# EAGLE schematic M837 (EAGLE 6.6.0)

## Sheet 1 of 3
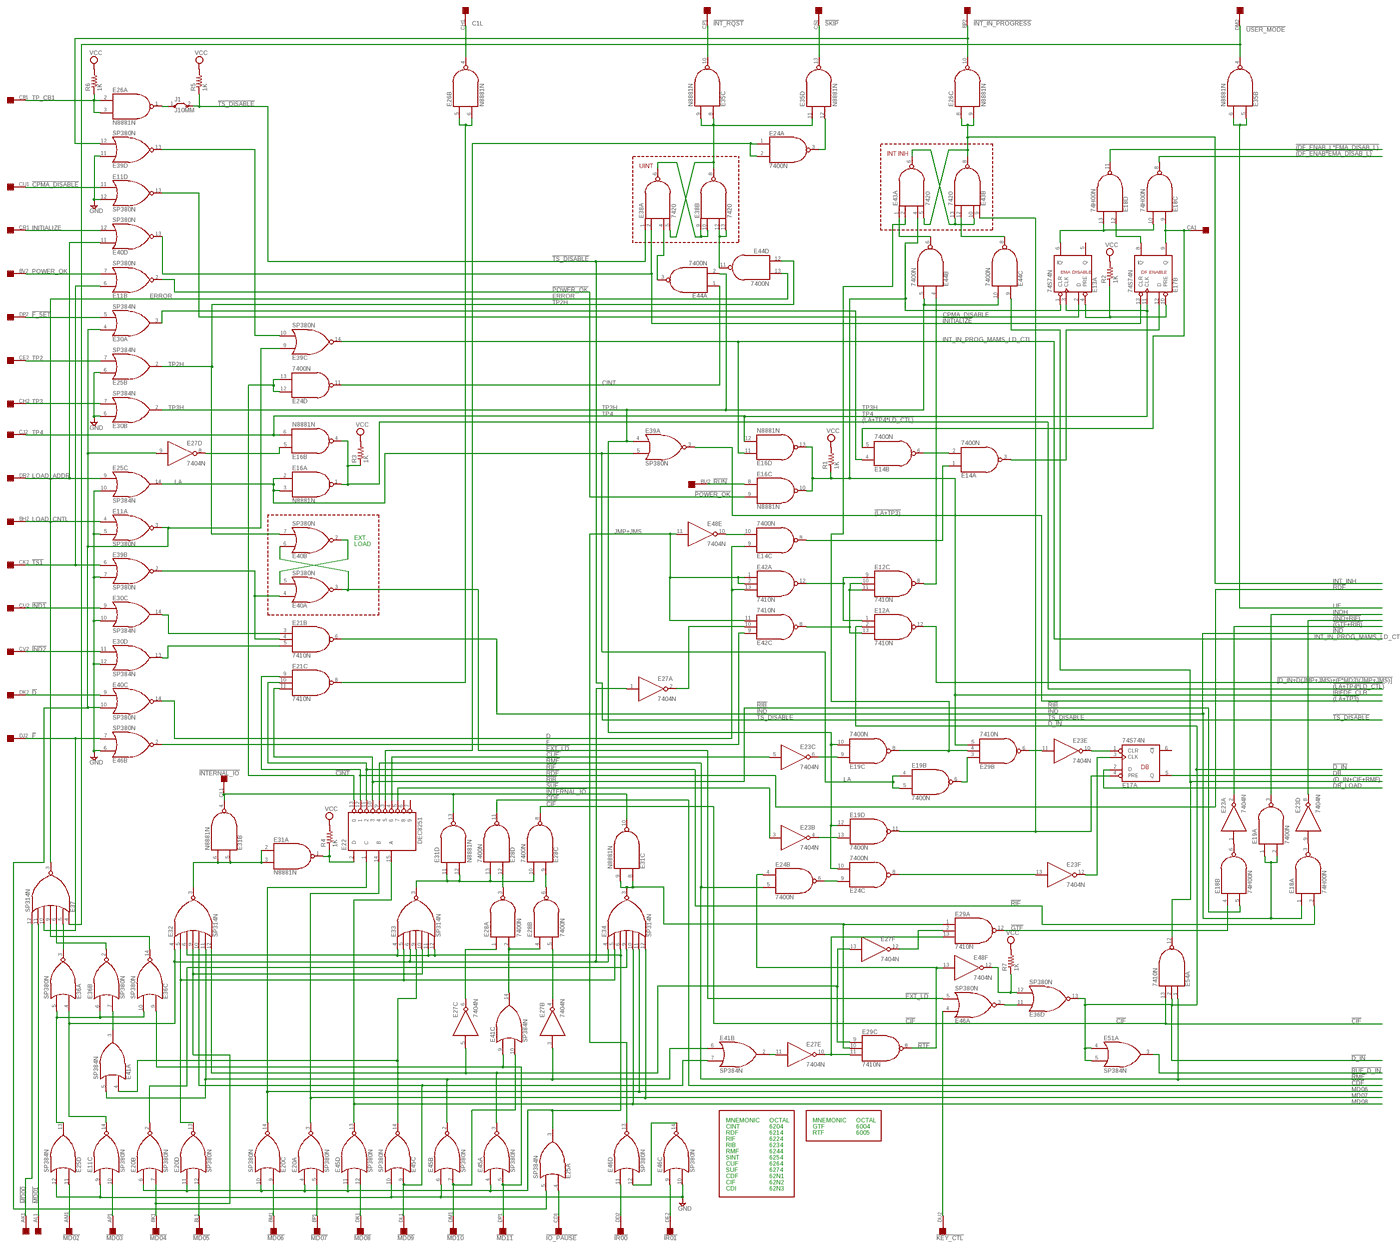
[diagram p0: schematic, sheet 1, overview]
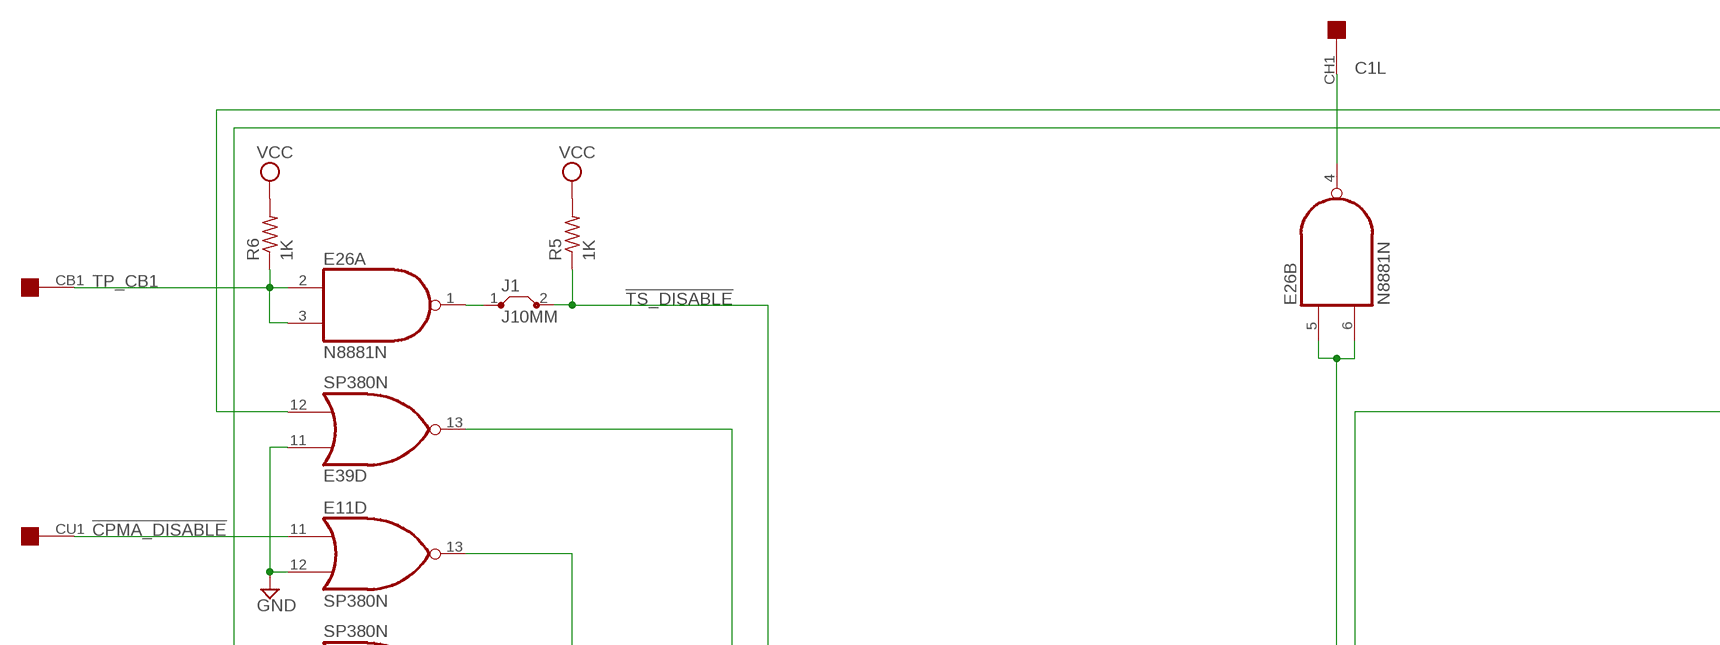
[diagram p1: schematic, sheet 1, part 1 of 4]
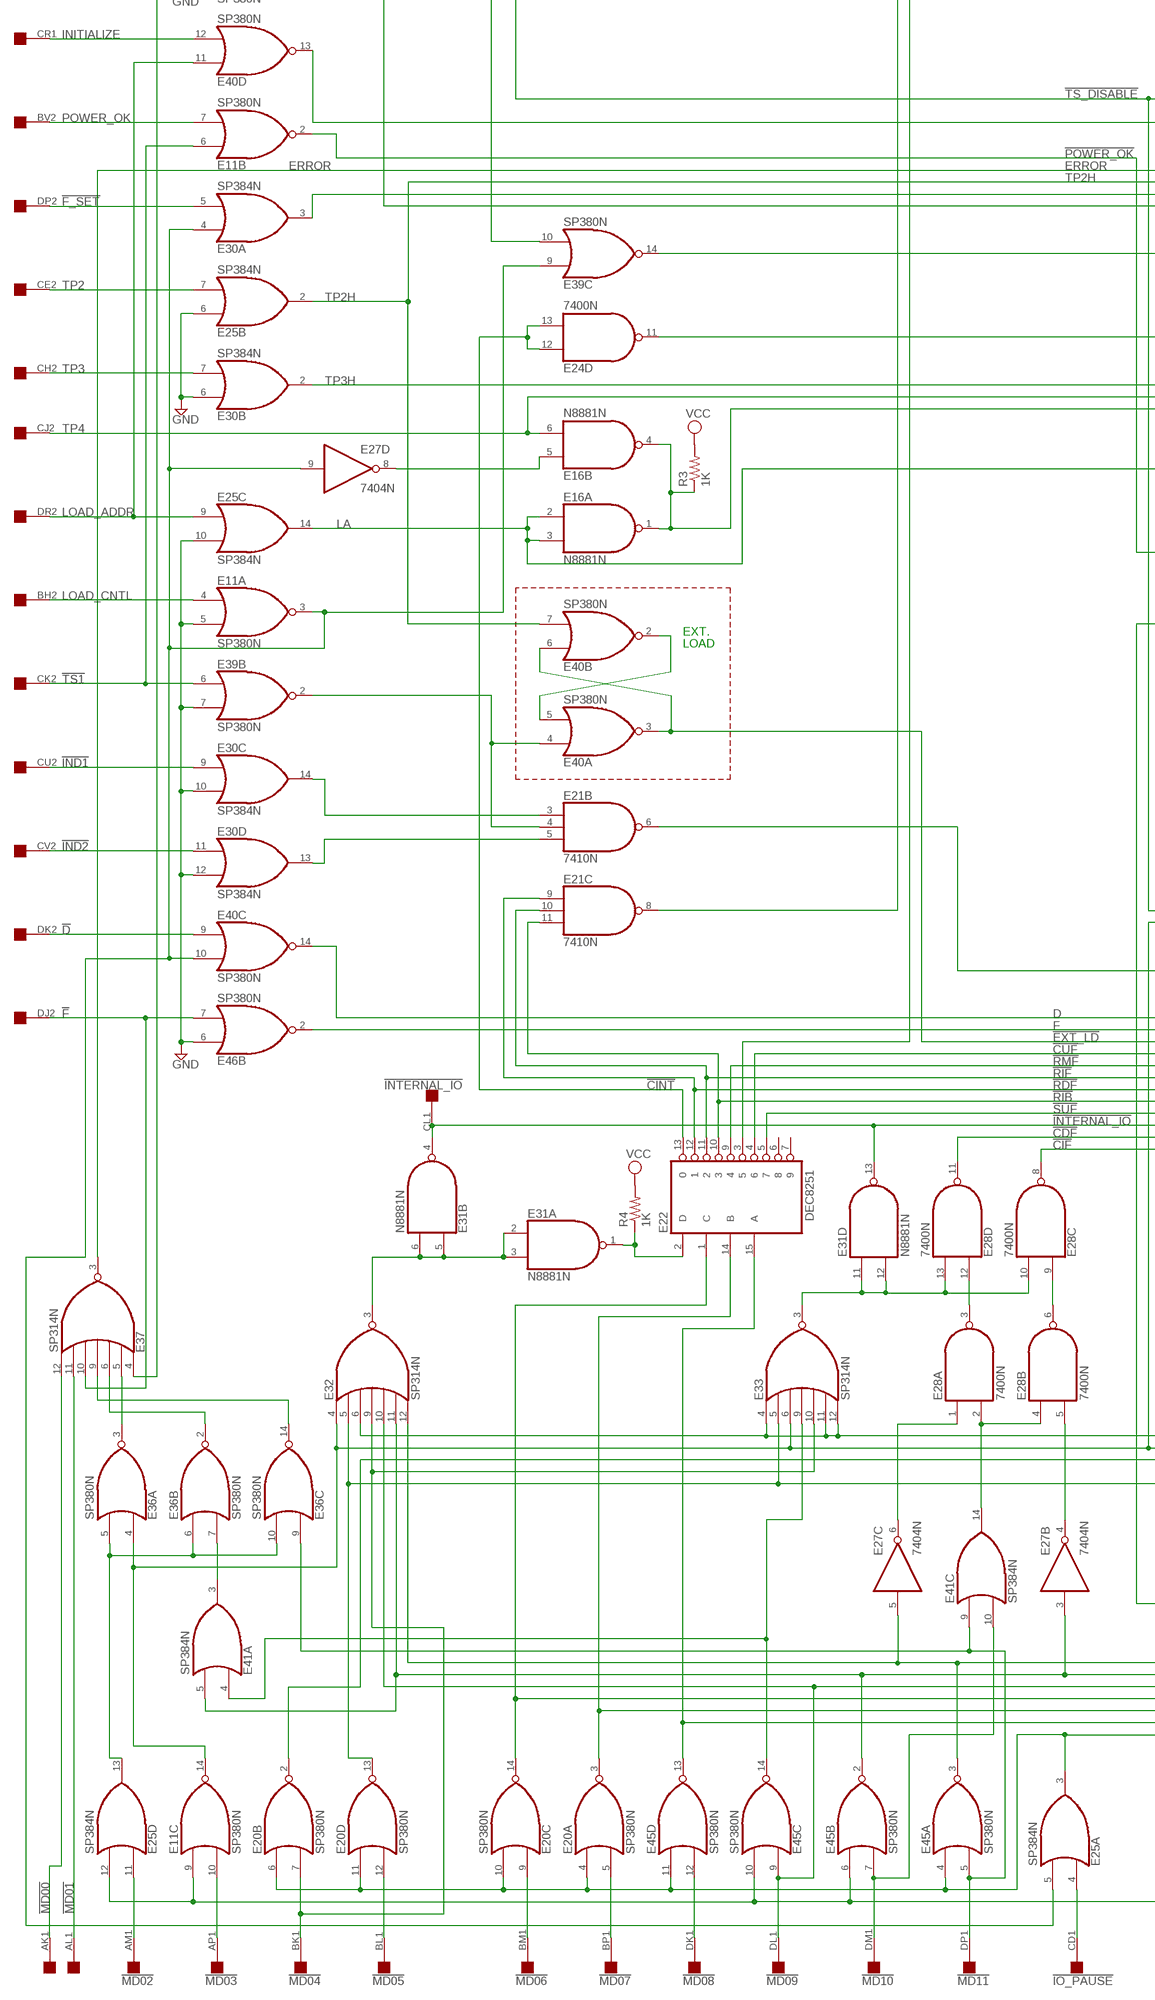
[diagram p2: schematic, sheet 1, part 2 of 4]
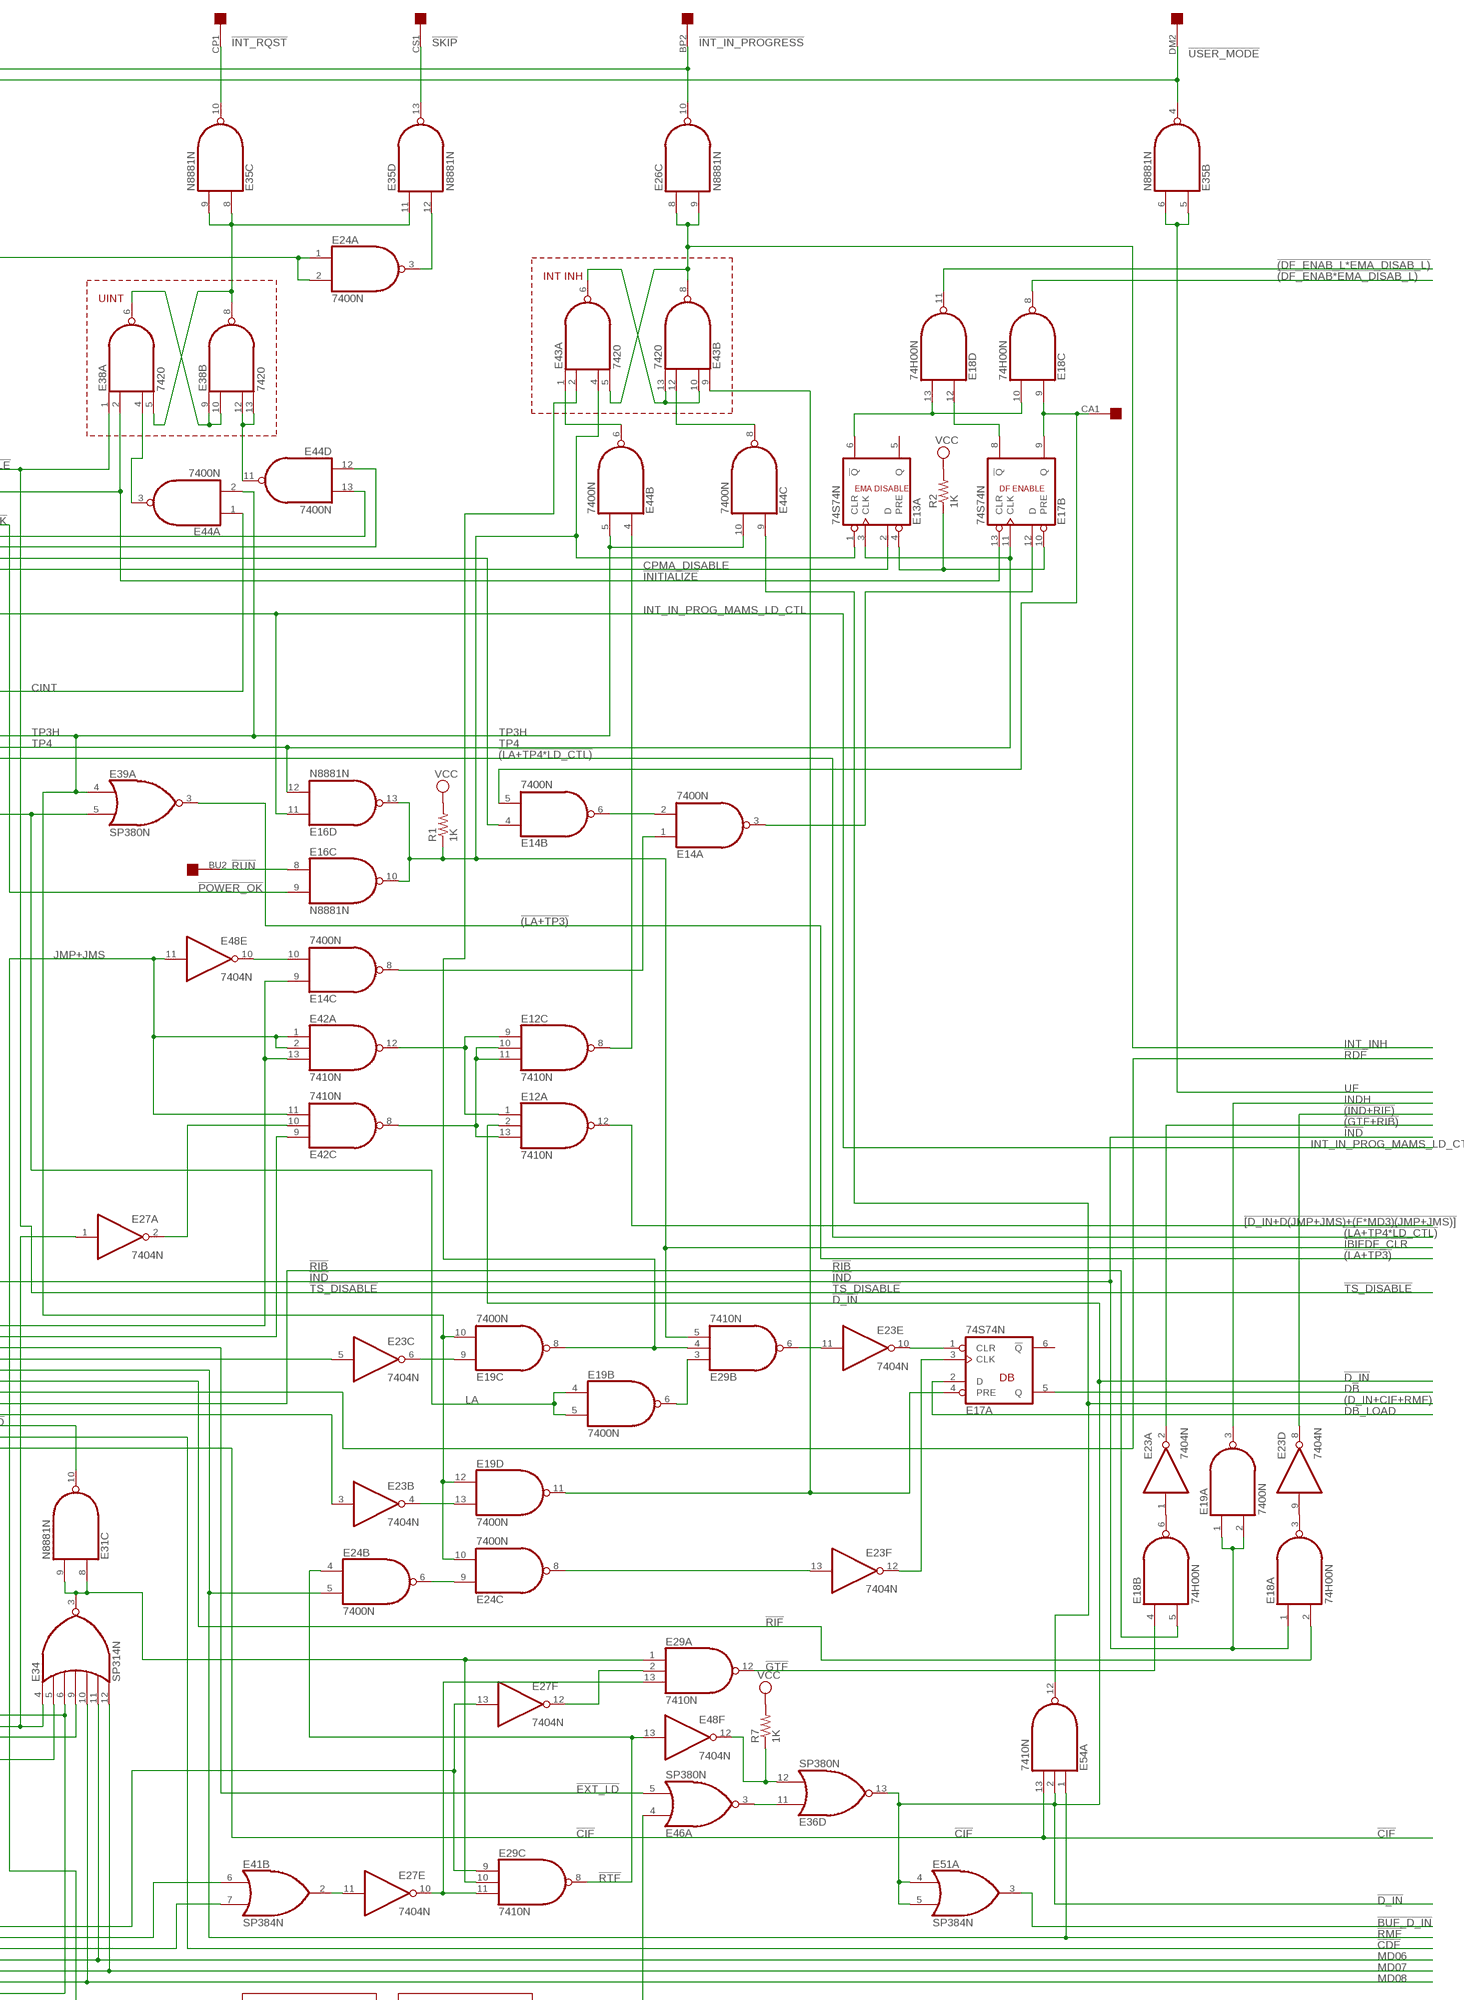
[diagram p3: schematic, sheet 1, part 3 of 4]
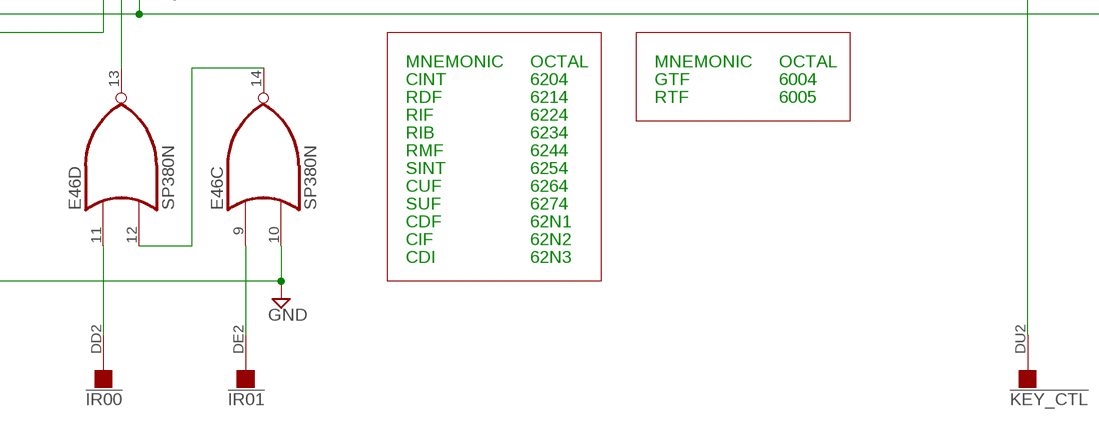
[diagram p4: schematic, sheet 1, part 4 of 4]

### Parts
E11  SP380N  [DIL14]
E12  7410N  [DIL14]
E13  74S74N  [DIL14]
E14  7400N  [DIL14]
E16  N8881N  [DIL14]
E17  74S74N  [DIL14]
E18  74H00N  74S00N  [DIL14]
E19  7400N  [DIL14]
E20  SP380N  [DIL14]
E21  7410N  [DIL14]
E22  DEC8251  [DIL16]
E23  7404N  [DIL14]
E24  7400N  [DIL14]
E25  SP384N  [DIL14]
E26  N8881N  [DIL14]
E27  7404N  [DIL14]
E28  7400N  [DIL14]
E29  7410N  74S10N  [DIL14]
E30  SP384N  [DIL14]
E31  N8881N  [DIL14]
E32  SP314N  [DIL14]
E33  SP314N  [DIL14]
E34  SP314N  [DIL14]
E35  N8881N  [DIL14]
E36  SP380N  [DIL14]
E37  SP314N  [DIL14]
E38  7420  74S20N  [DIL14]
E39  SP380N  [DIL14]
E40  SP380N  [DIL14]
E41  SP384N  [DIL14]
E42  7410N  [DIL14]
E43  7420  74S20N  [DIL14]
E44  7400N  [DIL14]
E45  SP380N  [DIL14]
E46  SP380N  [DIL14]
E48  7404N  [DIL14]
E51  SP384N  [DIL14]
E54  7410N  [DIL14]
EDGE  QUAD  [EDGE-CON8]
J1  J10MM  [10]
R1  1K  R-US_0207/10  [0207/10]
R2  1K  R-US_0207/10  [0207/10]
R3  1K  R-US_0207/10  [0207/10]
R4  1K  R-US_0207/10  [0207/10]
R5  1K  R-US_0207/10  [0207/10]
R6  1K  R-US_0207/10  [0207/10]
R7  1K  R-US_0207/10  [0207/10]

### Nets
!(DF_ENAB*EMA_DISAB_L): E18.8(C:O)
!(DF_ENAB_L*EMA_DISAB_L): E18.11(D:O)
!(GTF+RIB): E23.2(A:O) ; also sheet 2
!(IND+RIF): E23.8(D:O) ; also sheet 2
!(LA+TP3): E39.3(A:O) ; also sheet 2
!(LA+TP4*LD_CTL): E16.1(A:O) E16.4(B:O) R3.1 ; also sheet 2
![D_IN+D(JMP+JMS)+(F*MD3)(JMP+JMS)]: E12.12(A:O) ; also sheet 2
!BUF_D_IN: E51.3(A:O) ; also sheet 2
!CDF: E28.11(D:O) ; also sheet 2
!CIF: E28.8(C:O) E54.13(A:I2) ; also sheet 2
!CINT: E22.13 E24.12(D:I0) E24.13(D:I1)
!CPMA_DISABLE: E11.11(D:I0) EDGE.CU1
!CUF: E22.4 E23.5(C:I)
!D: E40.9(C:I0) EDGE.DK2
!D_IN: E12.2(A:I1) E36.13(D:O) E51.4(A:I0) E51.5(A:I1) E54.2(A:I1) ; also sheet 2
!DF_ENABLE: E17.8(B:!Q) E18.12(D:I0)
!EXT_LD: E40.3(A:O) E40.6(B:I0) E46.5(A:I1)
!F: E37.10(I4) E46.7(B:I1) EDGE.DJ2
!F_SET: E30.5(A:I1) EDGE.DP2
!GTF: E18.4(B:I0) E29.12(A:O)
!IBIFDF_CLR: E13.1(A:CLR) E16.10(C:O) E16.13(D:O) E29.5(B:I2) E43.4(A:I2) R1.1 ; also sheet 2
!IND: E18.1(A:I0) E19.1(A:I0) E19.2(A:I1) E21.6(B:O) ; also sheet 2
!IND1: E30.9(C:I0) EDGE.CU2
!IND2: E30.11(D:I0) EDGE.CV2
!INITIALIZE: E17.13(B:CLR) E38.2(A:I1) E40.13(D:O)
!INT_IN_PROGRESS: E26.10(C:O) E39.12(D:I1) EDGE.BP2
!INT_RQST: E35.10(C:O) EDGE.CP1
!INTERNAL_IO: E31.4(B:O) E31.10(C:O) E31.13(D:O) EDGE.CL1
!IO_PAUSE: E25.4(A:I0) EDGE.CD1
!IR00: E46.11(D:I0) EDGE.DD2
!IR01: E46.9(C:I0) EDGE.DE2
!KEY_CTL: E46.4(A:I0) EDGE.DU2
!LOAD_CNTL: E11.3(A:O) E25.5(A:I1) E27.9(D:I) E30.4(A:I0) E39.9(C:I0) E40.10(C:I1)
!MD00: E37.12(I6) EDGE.AK1
!MD01: E37.11(I5) EDGE.AL1
!MD02: E25.11(D:I0) EDGE.AM1
!MD03: E11.10(C:I1) EDGE.AP1
!MD04: E20.7(B:I1) E32.9(I3) E33.10(I4) EDGE.BK1
!MD05: E20.12(D:I1) EDGE.BL1
!MD06: E20.9(C:I0) EDGE.BM1
!MD07: E20.5(A:I1) EDGE.BP1
!MD08: E45.12(D:I1) EDGE.DK1
!MD09: E32.10(I4) E41.7(B:I1) E45.9(C:I0) EDGE.DL1
!MD10: E41.10(C:I1) E45.7(B:I1) EDGE.DM1
!MD11: E36.9(C:I0) E41.9(C:I0) E45.5(A:I1) EDGE.DP1
!POWER_OK: E11.2(B:O) E16.9(C:I1)
!RDF: E21.9(C:I0) E22.12 ; also sheet 2
!RIB: E18.5(B:I1) E21.11(C:I2) E22.10
!RIF: E18.2(A:I1) E21.10(C:I1) E22.11
!RMF: E22.9 E24.5(B:I1) E54.1(A:I0) ; also sheet 2
!RTF: E24.4(B:I0) E29.8(C:O) E48.13(F:I)
!RUN: E16.8(C:I0) EDGE.BU2
!SINT: E22.3 E24.1(A:I0) E24.2(A:I1)
!SKIP: E35.13(D:O) EDGE.CS1
!SUF: E22.5 E23.3(B:I)
!TS1: E11.6(B:I0) E39.6(B:I0) EDGE.CK2
!TS_DISABLE [Supply]: E38.1(A:I0) J1.2 R5.1 ; also sheet 2
!USER_MODE: E35.4(B:O) E37.4(I0) EDGE.DM2
(D_IN+CIF+RMF): E44.9(C:I0) E54.12(A:O) ; also sheet 2
C1L: E26.4(B:O) EDGE.CH1
CINT: E24.11(D:O) E44.1(A:I0)
CPMA_DISABLE: E11.13(D:O) E13.2(A:D)
D: E14.9(C:I0) E40.14(C:O) E42.13(A:I2)
DB: E17.5(A:Q) ; also sheet 2
DB_LOAD: E17.2(A:D) ; also sheet 2
DF_ENABLE: E14.5(B:I1) E17.9(B:Q) E18.9(C:I0) EDGE.CA1
ERROR: E37.3(O) E44.13(D:I1)
F: E42.9(C:I0) E46.2(B:O)
GND [Supply]: E11.5(A:I1) E11.9(C:I0) E11.12(D:I1) E25.6(B:I0) E25.10(C:I1) E25.12(D:I1) E30.6(B:I0) E30.10(C:I1) E30.12(D:I1) E39.7(B:I1) E39.11(D:I0) E45.6(B:I0) E45.10(C:I1) E46.6(B:I0) E46.10(C:I1) ; also sheet 2,3
IND1L: E21.3(B:I0) E30.14(C:O)
IND2L: E21.5(B:I2) E30.13(D:O)
INDH: E19.3(A:O) ; also sheet 2
INITIALIZE: E40.12(D:I1) EDGE.CR1
INT_IN_PROG_MAMS_LD_CTL: E16.11(D:I0) E39.14(C:O) ; also sheet 2
INT_IN_PROGRESS: E39.10(C:I1) E39.13(D:O)
INT_INH: E26.8(C:I0) E26.9(C:I1) E43.5(A:I3) E43.8(B:O) ; also sheet 2
IR01: E46.12(D:I1) E46.14(C:O)
JMP+JMS: E42.1(A:I0) E42.2(A:I1) E42.11(C:I2) E46.13(D:O) E48.11(E:I)
LA: E16.2(A:I0) E16.3(A:I1) E19.4(B:I0) E19.5(B:I1) E25.14(C:O) E39.5(A:I1)
LOAD_ADDR: E25.9(C:I0) E40.11(D:I0) EDGE.DR2
LOAD_CNTL: E11.4(A:I0) EDGE.BH2
LOAD_CNTLH: E16.5(B:I0) E27.8(D:O)
MD03: E11.14(C:O) E27.1(A:I) E32.4(I0) E33.6(I2) E34.4(I0) E36.4(A:I0)
MD03L: E27.2(A:O) E42.10(C:I1)
MD06: E20.14(C:O) E22.1(C) E34.11(I5) ; also sheet 2
MD07: E20.3(A:O) E22.14(B) E34.12(I6) ; also sheet 2
MD08: E22.15(A) E34.10(I4) E45.13(D:O) ; also sheet 2
MD09: E33.9(I3) E41.4(A:I0) E45.14(C:O)
MD10: E27.3(B:I) E32.11(I5) E41.5(A:I1) E41.6(B:I0) E45.2(B:O)
MYC1: E21.8(C:O) E26.5(B:I0) E26.6(B:I1)
N$1: E24.3(A:O) E35.12(D:I1)
N$2 [Supply]: E26.1(A:O) J1.1
N$3: E27.10(E:O) E29.11(C:I2) E29.13(A:I2)
N$4: E22.2(D) E31.1(A:O) R4.1
N$5: E31.2(A:I0) E31.3(A:I1) E31.5(B:I0) E31.6(B:I1) E32.3(O)
N$6: E36.3(A:O) E37.5(I1)
N$8: E36.2(B:O) E37.6(I2)
N$9: E36.14(C:O) E37.9(I3)
N$11: E14.2(A:I1) E14.6(B:O)
N$13: E38.4(A:I2) E44.3(A:O)
N$14: E40.2(B:O) E40.5(A:I1)
N$19: E27.11(E:I) E41.2(B:O)
N$21: E38.12(B:I2) E38.13(B:I3) E44.11(D:O)
N$22: E20.4(A:I0) E20.6(B:I0) E20.10(C:I1) E20.11(D:I0) E25.3(A:O) E32.6(I2) E33.4(I0) E33.11(I5) E33.12(I6) E34.6(I2) E45.4(A:I0) E45.11(D:I0)
N$23: E38.6(A:O) E38.9(B:I0) E38.10(B:I1)
N$24: E23.13(F:I) E24.8(C:O)
N$25: E43.6(A:O) E43.10(B:I1) E43.13(B:I3)
N$26: E25.13(D:O) E36.5(A:I1) E36.6(B:I0) E36.10(C:I1)
N$27: E29.1(A:I0) E29.10(C:I1) E31.8(C:I0) E31.9(C:I1) E34.3(O)
N$28: E14.1(A:I0) E14.8(C:O)
N$29: E36.7(B:I1) E41.3(A:O)
N$32: E17.3(A:CLK) E23.12(F:O)
N$33: E20.2(B:O) E34.9(I3)
N$34: E20.13(D:O) E32.5(I1) E33.5(I1) E34.5(I1)
N$36: E14.10(C:I1) E48.10(E:O)
N$37: E18.3(A:O) E23.9(D:I)
N$40: E12.10(C:I1) E12.11(C:I2) E12.13(A:I2) E42.8(C:O)
N$42: E13.4(A:PRE) E17.10(B:PRE) R2.1
N$43: E14.4(B:I0) E30.3(A:O)
N$44: E12.1(A:I0) E12.9(C:I0) E42.12(A:O)
N$47: E18.6(B:O) E23.1(A:I)
N$49: E14.3(A:O) E17.12(B:D)
N$50: E28.2(A:I1) E28.4(B:I0) E41.14(C:O)
N$51: E13.6(A:!Q) E18.10(C:I1) E18.13(D:I1)
N$52: E19.6(B:O) E29.3(B:I0)
N$53: E19.8(C:O) E29.4(B:I1) E43.2(A:I1)
N$54: E28.10(C:I1) E28.13(D:I1) E31.11(D:I0) E31.12(D:I1) E33.3(O)
N$55: E28.3(A:O) E28.12(D:I0)
N$56: E28.6(B:O) E28.9(C:I0)
N$57: E27.5(C:I) E27.13(F:I) E29.9(C:I0) E32.12(I6) E45.3(A:O)
N$58: E27.6(C:O) E28.1(A:I0)
N$59: E27.4(B:O) E28.5(B:I1)
N$62: E24.6(B:O) E24.9(C:I0)
N$63: E19.13(D:I1) E23.4(B:O)
N$64: E19.9(C:I0) E23.6(C:O)
N$65: E17.1(A:CLR) E23.10(E:O)
N$66: E23.11(E:I) E29.6(B:O)
N$67: E27.12(F:O) E29.2(A:I1)
N$68: E36.11(D:I0) E46.3(A:O)
N$69: E17.4(A:PRE) E19.11(D:O) E43.9(B:I0)
N$71: E12.8(C:O) E44.4(B:I0)
N$72: E43.1(A:I0) E44.6(B:O)
N$73: E43.12(B:I2) E44.8(C:O)
POWER_OK: E11.7(B:I1) EDGE.BV2
RTF: E36.12(D:I1) E48.12(F:O) R7.1
TP2: E25.7(B:I1) EDGE.CE2
TP2H: E25.2(B:O) E40.7(B:I1) E44.12(D:I0)
TP3: E30.7(B:I1) EDGE.CH2
TP3H: E19.10(C:I1) E19.12(D:I0) E24.10(C:I1) E30.2(B:O) E39.4(A:I0) E44.2(A:I1) E44.5(B:I1) E44.10(C:I1)
TP4: E13.3(A:CLK) E16.6(B:I1) E16.12(D:I1) E17.11(B:CLK) EDGE.CJ2
TP_CB1: E26.2(A:I0) E26.3(A:I1) EDGE.CB1 R6.1
TS1: E21.4(B:I1) E39.2(B:O) E40.4(A:I0)
UF: E35.5(B:I0) E35.6(B:I1) ; also sheet 2
UINT: E35.8(C:I0) E35.9(C:I1) E35.11(D:I0) E38.5(A:I3) E38.8(B:O)
VCC [Supply]: R1.2 R2.2 R3.2 R4.2 R5.2 R6.2 R7.2 ; also sheet 2,3
Unconnected: E13.5(A:Q) E13.8(B:!Q) E13.9(B:Q) E13.10(B:PRE) E13.11(B:CLK) E13.12(B:D) E13.13(B:CLR) E17.6(A:!Q) E21.1(A:I0) E21.2(A:I1) E21.12(A:O) E21.13(A:I2) E22.6 E22.7 E26.11(D:I0) E26.12(D:I1) E26.13(D:O) E35.1(A:O) E35.2(A:I0) E35.3(A:I1) E41.11(D:I0) E41.12(D:I1) E41.13(D:O) E42.3(B:I0) E42.4(B:I1) E42.5(B:I2) E42.6(B:O) E48.1(A:I) E48.2(A:O) E48.3(B:I) E48.4(B:O) E54.8(C:O) E54.9(C:I0) E54.10(C:I1) E54.11(C:I2) EDGE.AB2 EDGE.AC1 EDGE.AD1 EDGE.AE1 EDGE.AH1 EDGE.AJ1 EDGE.AJ2 EDGE.AK2 EDGE.AL2 EDGE.AM2 EDGE.AN1 EDGE.AN2 EDGE.AP2 EDGE.AR1 EDGE.AR2 EDGE.AS1 EDGE.AS2 EDGE.AU1 EDGE.AU2 EDGE.AV2 EDGE.BB2 EDGE.BD1 EDGE.BD2 EDGE.BE1 EDGE.BE2 EDGE.BH1 EDGE.BJ1 EDGE.BJ2 EDGE.BK2 EDGE.BL2 EDGE.BM2 EDGE.BN1 EDGE.BN2 EDGE.BR1 EDGE.BR2 EDGE.BS2 EDGE.CB2 EDGE.CD2 EDGE.CE1 EDGE.CJ1 EDGE.CK1 EDGE.CL2 EDGE.CM1 EDGE.CM2 EDGE.CN1 EDGE.CN2 EDGE.CP2 EDGE.CR2 EDGE.CS2 EDGE.CV1 EDGE.DA1 EDGE.DA2 EDGE.DB1 EDGE.DB2 EDGE.DD1 EDGE.DE1 EDGE.DH1 EDGE.DH2 EDGE.DJ1 EDGE.DL2 EDGE.DN1 EDGE.DN2 EDGE.DS2 EDGE.DV2

### Notes on the sheet
- INT INH
- UINT
- EMA DISABLE | DF ENABLE
- EXT.
- LOAD
- DB
- MNEMONIC | OCTAL | MNEMONIC | OCTAL
- CINT | 6204 | GTF | 6004
- RDF | 6214 | RTF | 6005
- RIF | 6224
- RIB | 6234
- RMF | 6244
- SINT | 6254
- CUF | 6264
- SUF | 6274
- CDF | 62N1
- CIF | 62N2
- CDI | 62N3

## Sheet 2 of 3
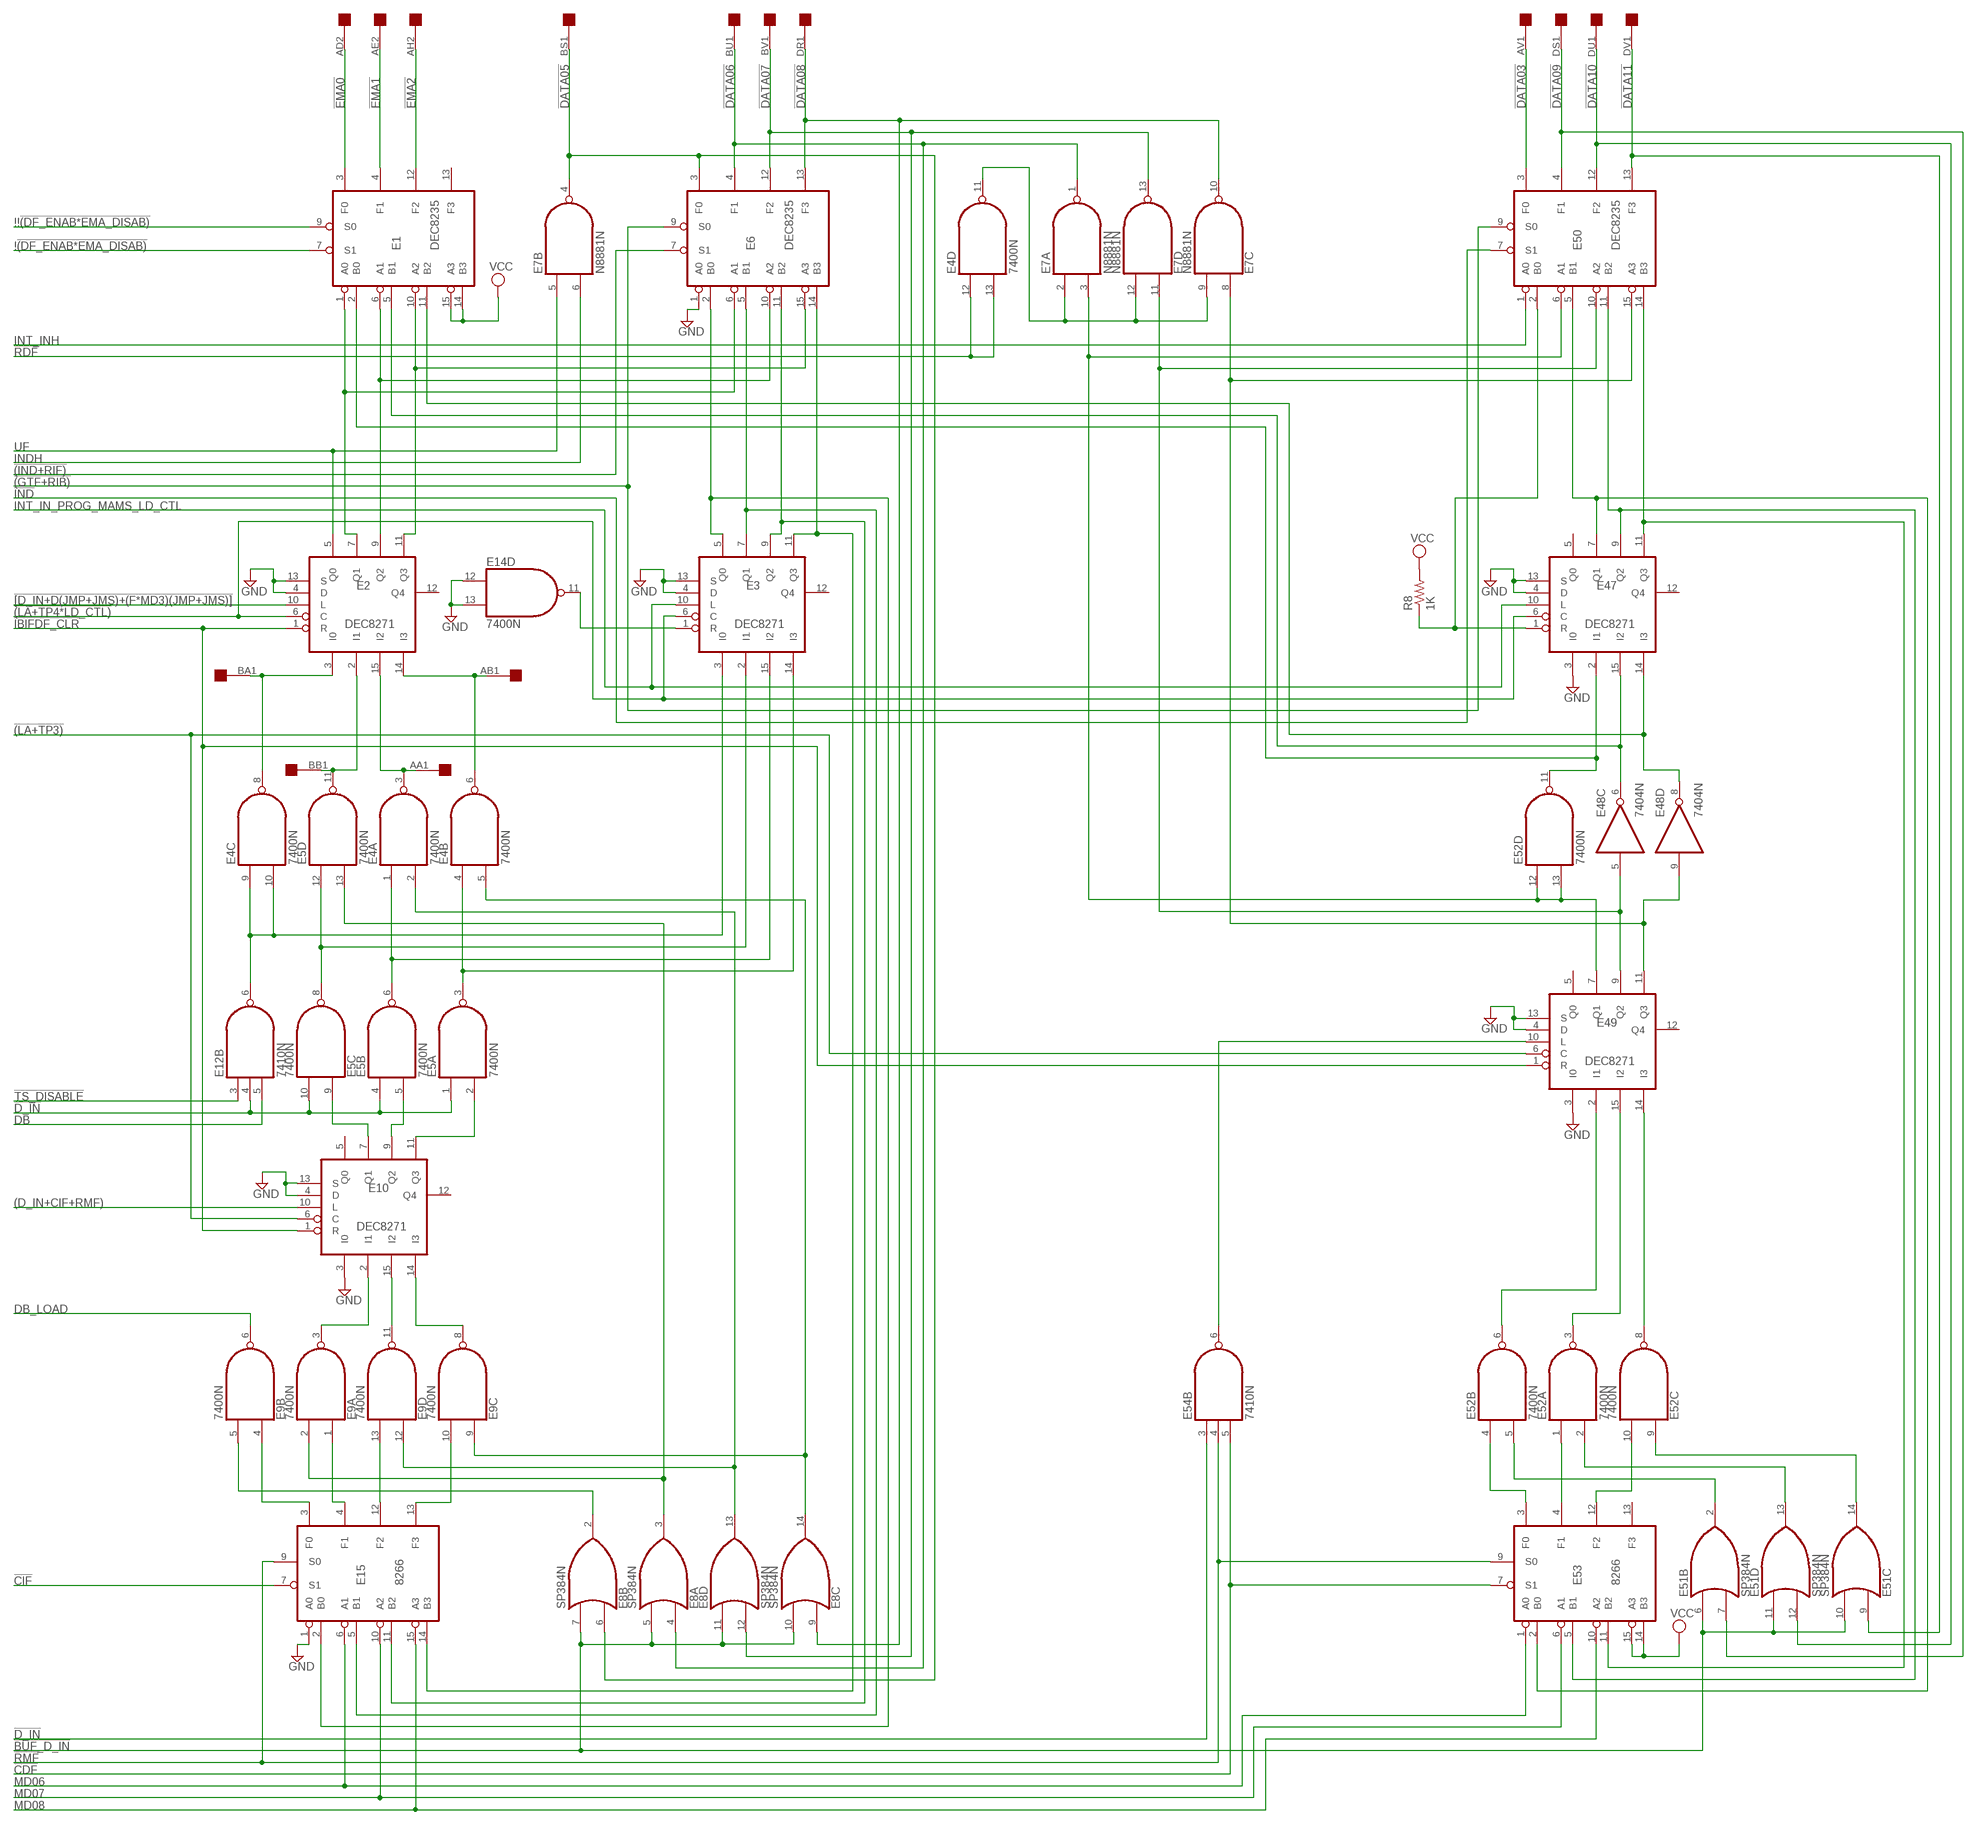
[diagram p5: schematic, sheet 2]

### Parts
E1  DEC8235  [DIL16]
E2  DEC8271  [DIL16]
E3  DEC8271  [DIL16]
E4  7400N  [DIL14]
E5  7400N  [DIL14]
E6  DEC8235  [DIL16]
E7  N8881N  [DIL14]
E8  SP384N  [DIL14]
E9  7400N  [DIL14]
E10  DEC8271  [DIL16]
E15  8266  [DIL16]
E47  DEC8271  [DIL16]
E49  DEC8271  [DIL16]
E50  DEC8235  [DIL16]
E52  7400N  [DIL14]
E53  8266  [DIL16]
R8  1K  R-US_0207/10  [0207/10]

### Nets
!!!(DF_ENAB*EMA_DISAB): E1.9(S0)
!!(DF_ENAB*EMA_DISAB): E1.7(S1)
!(GTF+RIB): E6.9(S0) E50.9(S0) ; also sheet 1
!(IND+RIF): E6.7(S1) ; also sheet 1
!(LA+TP3): E10.6(C) E49.6(C) ; also sheet 1
!(LA+TP4*LD_CTL): E2.6(C) E3.6(C) E47.6(C) ; also sheet 1
![D_IN+D(JMP+JMS)+(F*MD3)(JMP+JMS)]: E2.10(L) ; also sheet 1
!BUF_D_IN: E8.5(A:I1) E8.7(B:I1) E8.10(C:I1) E8.11(D:I0) E51.6(B:I0) E51.10(C:I1) E51.11(D:I0) ; also sheet 1
!CDF: E53.7(S1) E54.5(B:I2) ; also sheet 1
!CIF: E15.7(S1) ; also sheet 1
!D_IN: E5.1(A:I0) E5.4(B:I0) E5.10(C:I1) E12.4(B:I1) E54.3(B:I0) ; also sheet 1
!DATA03: E50.3(F0) EDGE.AV1
!DATA05: E6.3(F0) E7.4(B:O) E8.6(B:I0) EDGE.BS1
!DATA06: E6.4(F1) E7.1(A:O) E8.4(A:I0) EDGE.BU1
!DATA07: E6.12(F2) E7.13(D:O) E8.12(D:I1) EDGE.BV1
!DATA08: E6.13(F3) E7.10(C:O) E8.9(C:I0) EDGE.DR1
!DATA09: E50.4(F1) E51.7(B:I1) EDGE.DS1
!DATA10: E50.12(F2) E51.12(D:I1) EDGE.DU1
!DATA11: E50.13(F3) E51.9(C:I0) EDGE.DV1
!EMA0: E1.3(F0) EDGE.AD2
!EMA1: E1.4(F1) EDGE.AE2
!EMA2: E1.12(F2) EDGE.AH2
!IBIFDF_CLR: E2.1(R) E10.1(R) E49.1(R) ; also sheet 1
!IND: E50.7(S1) ; also sheet 1
!RDF: E4.12(D:I0) E4.13(D:I1) ; also sheet 1
!RMF: E15.9(S0) E53.9(S0) E54.4(B:I1) ; also sheet 1
!TS_DISABLE [Supply]: E12.3(B:I0) ; also sheet 1
(D_IN+CIF+RMF): E10.10(L) ; also sheet 1
DB: E12.5(B:I2) ; also sheet 1
DB_LOAD: E9.6(B:O) ; also sheet 1
GND [Supply]: E2.4(D) E2.13(S) E3.4(D) E3.13(S) E6.1(A0) E10.3(I0) E10.4(D) E10.13(S) E14.12(D:I0) E14.13(D:I1) E15.1(A0) E47.3(I0) E47.4(D) E47.13(S) E49.3(I0) E49.4(D) E49.13(S) ; also sheet 1,3
INDH: E7.6(B:I1) ; also sheet 1
INT_IN_PROG_MAMS_LD_CTL: E3.10(L) E47.10(L) ; also sheet 1
INT_INH: E50.1(A0) ; also sheet 1
MD06: E15.6(A1) E53.1(A0) ; also sheet 1
MD07: E15.10(A2) E53.6(A1) ; also sheet 1
MD08: E15.15(A3) E53.10(A2) ; also sheet 1
N$10: E3.5(Q0) E6.2(B0) E15.2(B0)
N$20: E3.7(Q1) E6.5(B1) E15.5(B1)
N$45: E3.9(Q2) E6.11(B2) E15.11(B2)
N$60: E3.11(Q3) E6.14(B3) E15.14(B3)
N$74: E9.4(B:I0) E15.3(F0)
N$75: E9.1(A:I0) E15.4(F1)
N$76: E9.13(D:I1) E15.12(F2)
N$77: E9.10(C:I1) E15.13(F3)
N$78: E8.2(B:O) E9.5(B:I1)
N$79: E5.13(D:I1) E8.3(A:O) E9.2(A:I1)
N$80: E4.2(A:I1) E8.13(D:O) E9.12(D:I0)
N$81: E4.5(B:I1) E8.14(C:O) E9.9(C:I0)
N$82: E9.11(D:O) E10.15(I2)
N$83: E9.3(A:O) E10.2(I1)
N$84: E9.8(C:O) E10.14(I3)
N$86: E3.14(I3) E4.4(B:I0) E5.3(A:O)
N$87: E3.15(I2) E4.1(A:I0) E5.6(B:O)
N$88: E5.9(C:I0) E10.7(Q1)
N$89: E5.5(B:I1) E10.9(Q2)
N$90: E5.2(A:I1) E10.11(Q3)
N$93: E3.2(I1) E5.8(C:O) E5.12(D:I0)
N$94: E3.3(I0) E4.9(C:I0) E4.10(C:I1) E12.6(B:O)
N$102: E1.1(A0) E2.7(Q1) E6.6(A1)
N$103: E1.6(A1) E2.9(Q2) E6.10(A2)
N$104: E1.10(A2) E2.11(Q3) E6.15(A3)
N$105: E1.11(B2) E47.14(I3) E48.8(D:O)
N$106: E1.5(B1) E47.15(I2) E48.6(C:O)
N$107: E1.2(B0) E47.2(I1) E52.11(D:O)
N$110: E49.10(L) E54.6(B:O)
N$118: E7.11(D:I0) E48.5(C:I) E49.9(Q2) E50.10(A2)
N$119: E7.8(C:I0) E48.9(D:I) E49.11(Q3) E50.15(A3)
N$120: E51.2(B:O) E52.5(B:I1)
N$121: E7.3(A:I1) E49.7(Q1) E50.6(A1) E52.12(D:I0) E52.13(D:I1)
N$122: E51.13(D:O) E52.2(A:I1)
N$124: E51.14(C:O) E52.9(C:I0)
N$126: E52.1(A:I0) E53.4(F1)
N$128: E47.11(Q3) E50.14(B3) E53.11(B2)
N$129: E47.9(Q2) E50.11(B2) E53.5(B1)
N$130: E47.7(Q1) E50.5(B1) E53.2(B0)
N$135: E52.10(C:I1) E53.12(F2)
N$137: E3.1(R) E14.11(D:O)
N$140: E52.4(B:I0) E53.3(F0)
N$141: E49.14(I3) E52.8(C:O)
N$142: E49.15(I2) E52.3(A:O)
N$143: E49.2(I1) E52.6(B:O)
N$145: E47.1(R) E50.2(B0) R8.1
RDF: E4.11(D:O) E7.2(A:I0) E7.9(C:I1) E7.12(D:I1)
TP_AA1: E2.15(I2) E4.3(A:O) EDGE.AA1
TP_AB1: E2.14(I3) E4.6(B:O) EDGE.AB1
TP_BA1: E2.3(I0) E4.8(C:O) EDGE.BA1
TP_BB1: E2.2(I1) E5.11(D:O) EDGE.BB1
UF: E2.5(Q0) E7.5(B:I0) ; also sheet 1
VCC [Supply]: E1.14(B3) E1.15(A3) E53.14(B3) E53.15(A3) R8.2 ; also sheet 1,3
Unconnected: E1.13(F3) E2.12(Q4) E3.12(Q4) E10.5(Q0) E10.12(Q4) E47.5(Q0) E47.12(Q4) E49.5(Q0) E49.12(Q4) E53.13(F3)

## Sheet 3 of 3
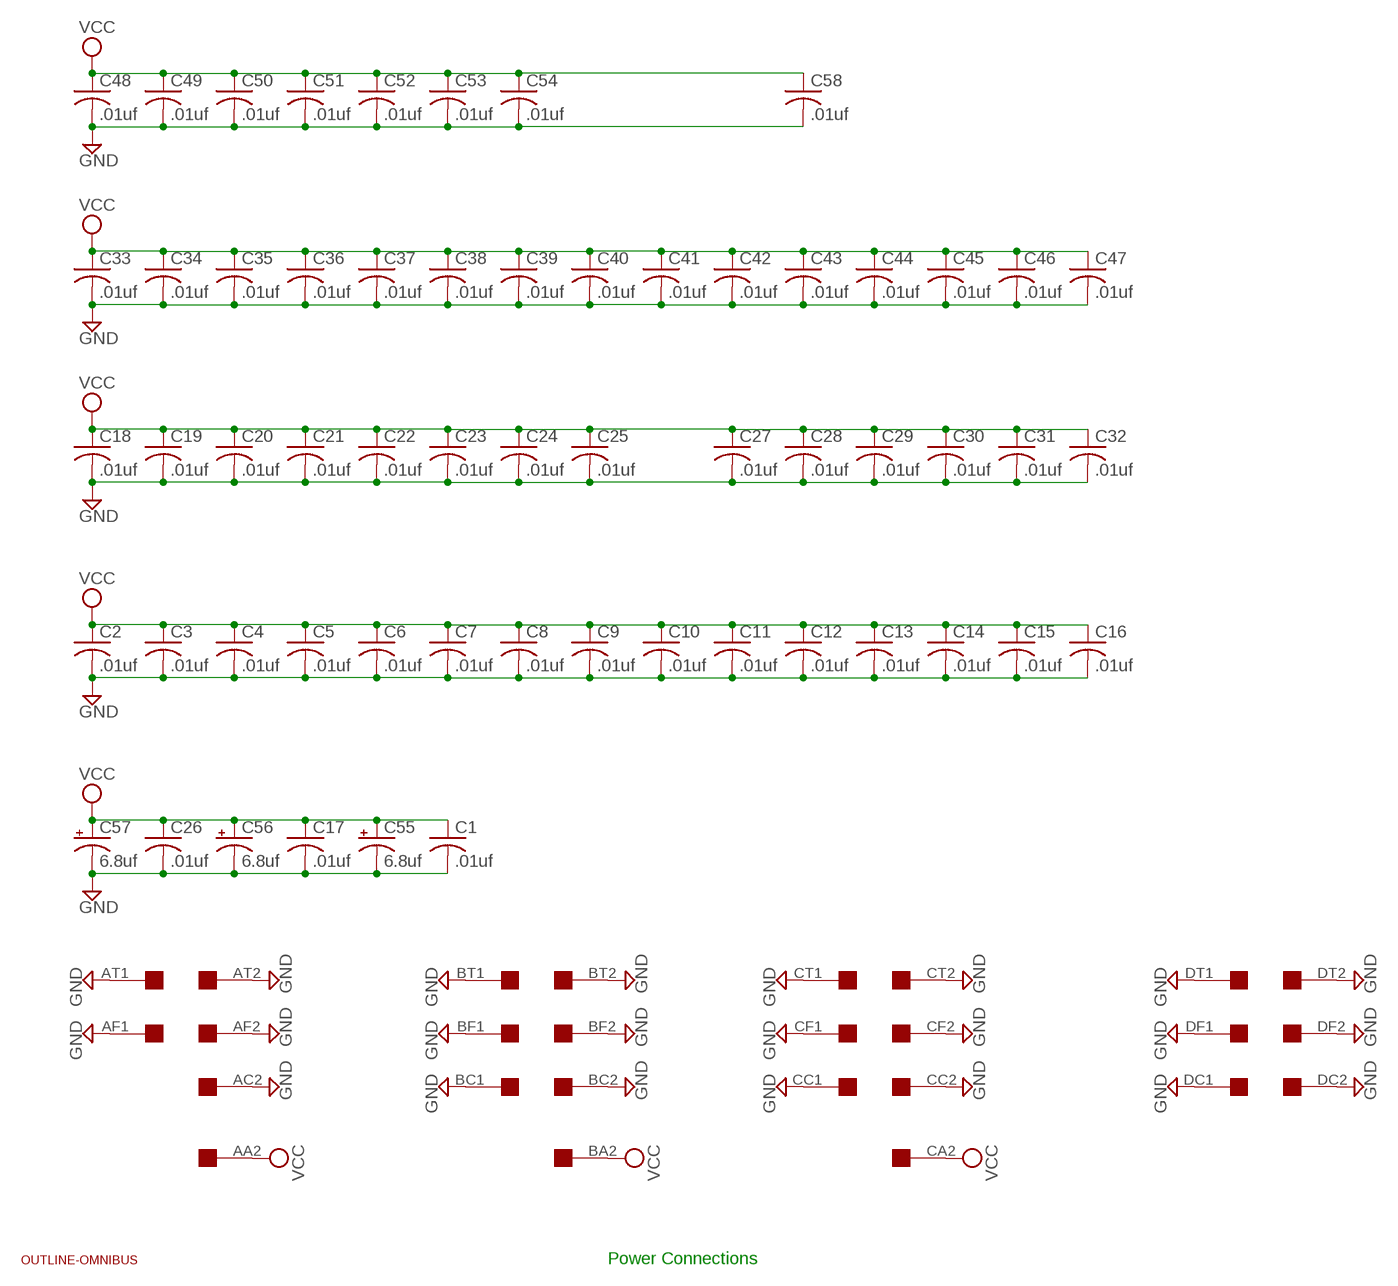
[diagram p6: schematic, sheet 3]

### Parts
C1  .01uf  C-US050-025X075  [C050-025X075]
C2  .01uf  C-US050-025X075  [C050-025X075]
C3  .01uf  C-US050-025X075  [C050-025X075]
C4  .01uf  C-US050-025X075  [C050-025X075]
C5  .01uf  C-US050-025X075  [C050-025X075]
C6  .01uf  C-US050-025X075  [C050-025X075]
C7  .01uf  C-US050-025X075  [C050-025X075]
C8  .01uf  C-US050-025X075  [C050-025X075]
C9  .01uf  C-US050-025X075  [C050-025X075]
C10  .01uf  C-US050-025X075  [C050-025X075]
C11  .01uf  C-US050-025X075  [C050-025X075]
C12  .01uf  C-US050-025X075  [C050-025X075]
C13  .01uf  C-US050-025X075  [C050-025X075]
C14  .01uf  C-US050-025X075  [C050-025X075]
C15  .01uf  C-US050-025X075  [C050-025X075]
C16  .01uf  C-US050-025X075  [C050-025X075]
C17  .01uf  C-US050-025X075  [C050-025X075]
C18  .01uf  C-US050-025X075  [C050-025X075]
C19  .01uf  C-US050-025X075  [C050-025X075]
C20  .01uf  C-US050-025X075  [C050-025X075]
C21  .01uf  C-US050-025X075  [C050-025X075]
C22  .01uf  C-US050-025X075  [C050-025X075]
C23  .01uf  C-US050-025X075  [C050-025X075]
C24  .01uf  C-US050-025X075  [C050-025X075]
C25  .01uf  C-US050-025X075  [C050-025X075]
C26  .01uf  C-US050-025X075  [C050-025X075]
C27  .01uf  C-US050-025X075  [C050-025X075]
C28  .01uf  C-US050-025X075  [C050-025X075]
C29  .01uf  C-US050-025X075  [C050-025X075]
C30  .01uf  C-US050-025X075  [C050-025X075]
C31  .01uf  C-US050-025X075  [C050-025X075]
C32  .01uf  C-US050-025X075  [C050-025X075]
C33  .01uf  C-US050-025X075  [C050-025X075]
C34  .01uf  C-US050-025X075  [C050-025X075]
C35  .01uf  C-US050-025X075  [C050-025X075]
C36  .01uf  C-US050-025X075  [C050-025X075]
C37  .01uf  C-US050-025X075  [C050-025X075]
C38  .01uf  C-US050-025X075  [C050-025X075]
C39  .01uf  C-US050-025X075  [C050-025X075]
C40  .01uf  C-US050-025X075  [C050-025X075]
C41  .01uf  C-US050-025X075  [C050-025X075]
C42  .01uf  C-US050-025X075  [C050-025X075]
C43  .01uf  C-US050-025X075  [C050-025X075]
C44  .01uf  C-US050-025X075  [C050-025X075]
C45  .01uf  C-US050-025X075  [C050-025X075]
C46  .01uf  C-US050-025X075  [C050-025X075]
C47  .01uf  C-US050-025X075  [C050-025X075]
C48  .01uf  C-US050-025X075  [C050-025X075]
C49  .01uf  C-US050-025X075  [C050-025X075]
C50  .01uf  C-US050-025X075  [C050-025X075]
C51  .01uf  C-US050-025X075  [C050-025X075]
C52  .01uf  C-US050-025X075  [C050-025X075]
C53  .01uf  C-US050-025X075  [C050-025X075]
C54  .01uf  C-US050-025X075  [C050-025X075]
C55  6.8uf  CPOL-USE22-6AXIAL  [E22-6]
C56  6.8uf  CPOL-USE22-6AXIAL  [E22-6]
C57  6.8uf  CPOL-USE22-6AXIAL  [E22-6]
C58  .01uf  C-US050-025X075  [C050-025X075]
U$1  OUTLINE-OMNIBUS  [OMNIBUS]

### Nets
GND [Supply]: C1.2 C2.2 C3.2 C4.2 C5.2 C6.2 C7.2 C8.2 C9.2 C10.2 C11.2 C12.2 C13.2 C14.2 C15.2 C16.2 C17.2 C18.2 C19.2 C20.2 C21.2 C22.2 C23.2 C24.2 C25.2 C26.2 C27.2 C28.2 C29.2 C30.2 C31.2 C32.2 C33.2 C34.2 C35.2 C36.2 C37.2 C38.2 C39.2 C40.2 C41.2 C42.2 C43.2 C44.2 C45.2 C46.2 C47.2 C48.2 C49.2 C50.2 C51.2 C52.2 C53.2 C54.2 C55.- C56.- C57.- C58.2 EDGE.AC2 EDGE.AF1 EDGE.AF2 EDGE.AT1 EDGE.AT2 EDGE.BC1 EDGE.BC2 EDGE.BF1 EDGE.BF2 EDGE.BT1 EDGE.BT2 EDGE.CC1 EDGE.CC2 EDGE.CF1 EDGE.CF2 EDGE.CT1 EDGE.CT2 EDGE.DC1 EDGE.DC2 EDGE.DF1 EDGE.DF2 EDGE.DT1 EDGE.DT2 ; also sheet 1,2
VCC [Supply]: C1.1 C2.1 C3.1 C4.1 C5.1 C6.1 C7.1 C8.1 C9.1 C10.1 C11.1 C12.1 C13.1 C14.1 C15.1 C16.1 C17.1 C18.1 C19.1 C20.1 C21.1 C22.1 C23.1 C24.1 C25.1 C26.1 C27.1 C28.1 C29.1 C30.1 C31.1 C32.1 C33.1 C34.1 C35.1 C36.1 C37.1 C38.1 C39.1 C40.1 C41.1 C42.1 C43.1 C44.1 C45.1 C46.1 C47.1 C48.1 C49.1 C50.1 C51.1 C52.1 C53.1 C54.1 C55.+ C56.+ C57.+ C58.1 EDGE.AA2 EDGE.BA2 EDGE.CA2 ; also sheet 1,2

### Notes on the sheet
- Power Connections

## Power pins joined to a net without a drawn wire
GND: E1.8(GND) E2.8(GND) E3.8(GND) E4.7(P:GND) E5.7(P:GND) E6.8(GND) E7.7(P:GND) E8.1(GND) E9.7(P:GND) E10.8(GND) E11.1(P:GND) E12.7(P:GND) E13.7(P:GND) E14.7(P:GND) E15.8(GND) E16.7(P:GND) E17.7(P:GND) E18.7(P:GND) E19.7(P:GND) E20.1(P:GND) E21.7(P:GND) E22.8(GND) E23.7(P:GND) E24.7(P:GND) E25.1(GND) E26.7(P:GND) E27.7(P:GND) E28.7(P:GND) E29.7(P:GND) E30.1(GND) E31.7(P:GND) E32.1(GND) E33.1(GND) E34.1(GND) E35.7(P:GND) E36.1(P:GND) E37.1(GND) E38.7(P:GND) E39.1(P:GND) E40.1(P:GND) E41.1(GND) E42.7(P:GND) E43.7(P:GND) E44.7(P:GND) E45.1(P:GND) E46.1(P:GND) E47.8(GND) E48.7(P:GND) E49.8(GND) E50.8(GND) E51.1(GND) E52.7(P:GND) E53.8(GND) E54.7(P:GND)
VCC: E1.16(VCC) E2.16(VCC) E3.16(VCC) E4.14(P:VCC) E5.14(P:VCC) E6.16(VCC) E7.14(P:VCC) E8.8(VCC) E9.14(P:VCC) E10.16(VCC) E11.8(P:VCC) E12.14(P:VCC) E13.14(P:VCC) E14.14(P:VCC) E15.16(VCC) E16.14(P:VCC) E17.14(P:VCC) E18.14(P:VCC) E19.14(P:VCC) E20.8(P:VCC) E21.14(P:VCC) E22.16(VCC) E23.14(P:VCC) E24.14(P:VCC) E25.8(VCC) E26.14(P:VCC) E27.14(P:VCC) E28.14(P:VCC) E29.14(P:VCC) E30.8(VCC) E31.14(P:VCC) E32.8(VCC) E33.8(VCC) E34.8(VCC) E35.14(P:VCC) E36.8(P:VCC) E37.8(VCC) E38.14(P:VCC) E39.8(P:VCC) E40.8(P:VCC) E41.8(VCC) E42.14(P:VCC) E43.14(P:VCC) E44.14(P:VCC) E45.8(P:VCC) E46.8(P:VCC) E47.16(VCC) E48.14(P:VCC) E49.16(VCC) E50.16(VCC) E51.8(VCC) E52.14(P:VCC) E53.16(VCC) E54.14(P:VCC)

## Library data of the parts
C1-C54 C58 = rcl:C-US: CAPACITOR, American symbol
C55-C57 = rcl:CPOL-US: POLARIZED CAPACITOR, American symbol
E1 E6 E50 = dec-con:DEC8235: 4-bit data selector
E2 E3 E10 E47 E49 = dec-con:DEC8271: Parallel Load Shift Register
E4 E5 E9 E14 E18 E19 E24 E28 E44 E52 = 74xx-us:74*00: Quad 2-input NAND gate
E7 E16 E26 E31 E35 = dec-con:N8881: Quad 2-input NAND gate, open collector
E8 E25 E30 E41 E51 = dec-con:SP384: Quad OR gate
E11 E20 E36 E39 E40 E45 E46 = dec-con:SP380: Quad NOR gate (use 8640)
E12 E21 E29 E42 E54 = 74xx-us:74*10: Triple 3-input NAND gate
E13 E17 = 74xx-us:74*74: Dual D type positive edge triggered FLIP FLOP, preset and clear
E15 E53 = dec-con:8266: Quad 2-1 selector
E22 = dec-con:DEC8251: BCD Decoder
E23 E27 E48 = 74xx-us:74*04: Hex INVERTER
E32-E34 E37 = dec-con:SP314: 7-Input NOR gate
E38 E43 = 74xx-us:74*20: Dual 4-input NAND gate
EDGE = dec-con:QUAD: Quad-Height DEC board
J1 = jumper:J: Bridge
R1-R8 = rcl:R-US_: RESISTOR, American symbol
U$1 = dec-con:OUTLINE-*: Board outlines for DEC boards.

## Net classes
1 Supply: width 0.762 mm, drill 0.762 mm, clearance 0.508 mm